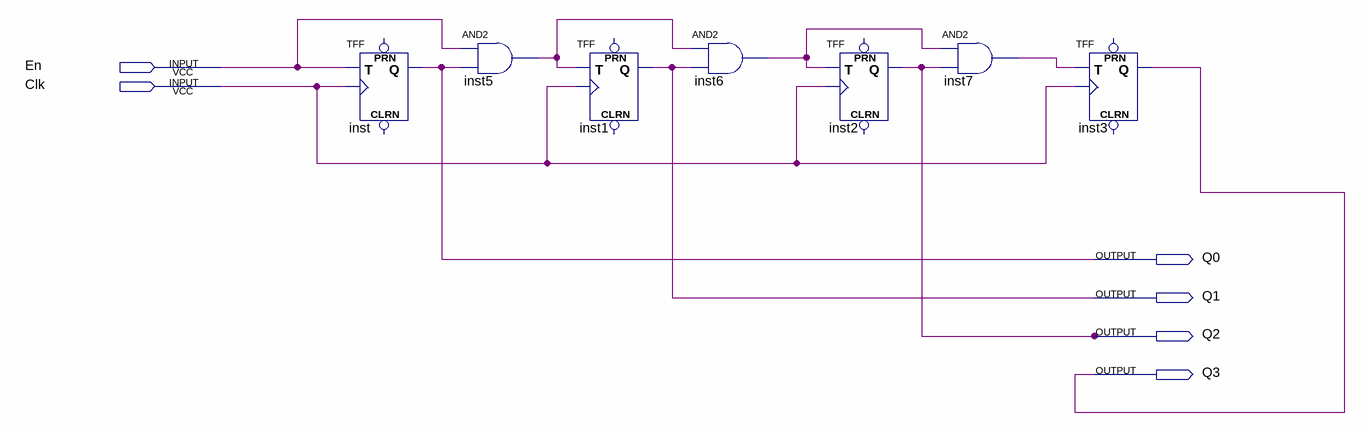
[diagram p0: schematic sheet]
// Quartus schematic lab10step2b.bdf as structural Verilog: 7 symbols, 6 pins
module lab10step2b (
  input  En,
  input  Clk,
  output Q0,
  output Q1,
  output Q2,
  output Q3
);

  wire inst5_out, inst6_out, inst7_out;

  TFF inst (.T(En), .CLK(Clk), .Q(Q0));  // open: PRN, CLRN
  and inst5 (inst5_out, En, Q0);
  TFF inst1 (.T(inst5_out), .CLK(Clk), .Q(Q1));  // open: PRN, CLRN
  and inst6 (inst6_out, inst5_out, Q1);
  TFF inst2 (.T(inst6_out), .CLK(Clk), .Q(Q2));  // open: PRN, CLRN
  and inst7 (inst7_out, inst6_out, Q2);
  TFF inst3 (.T(inst7_out), .CLK(Clk), .Q(Q3));  // open: PRN, CLRN
endmodule
